# Altium schematic sheet EXP_OBC_COMM.SchDoc: EXP_OBC_COMM
size A3; Date: 13/11/2025; DrawnBy: Văn Quý Tuân; Revision: 1; SheetNumber: 9; SheetTotal: 10; Size: A3; Subsystem: HW-11/11/25
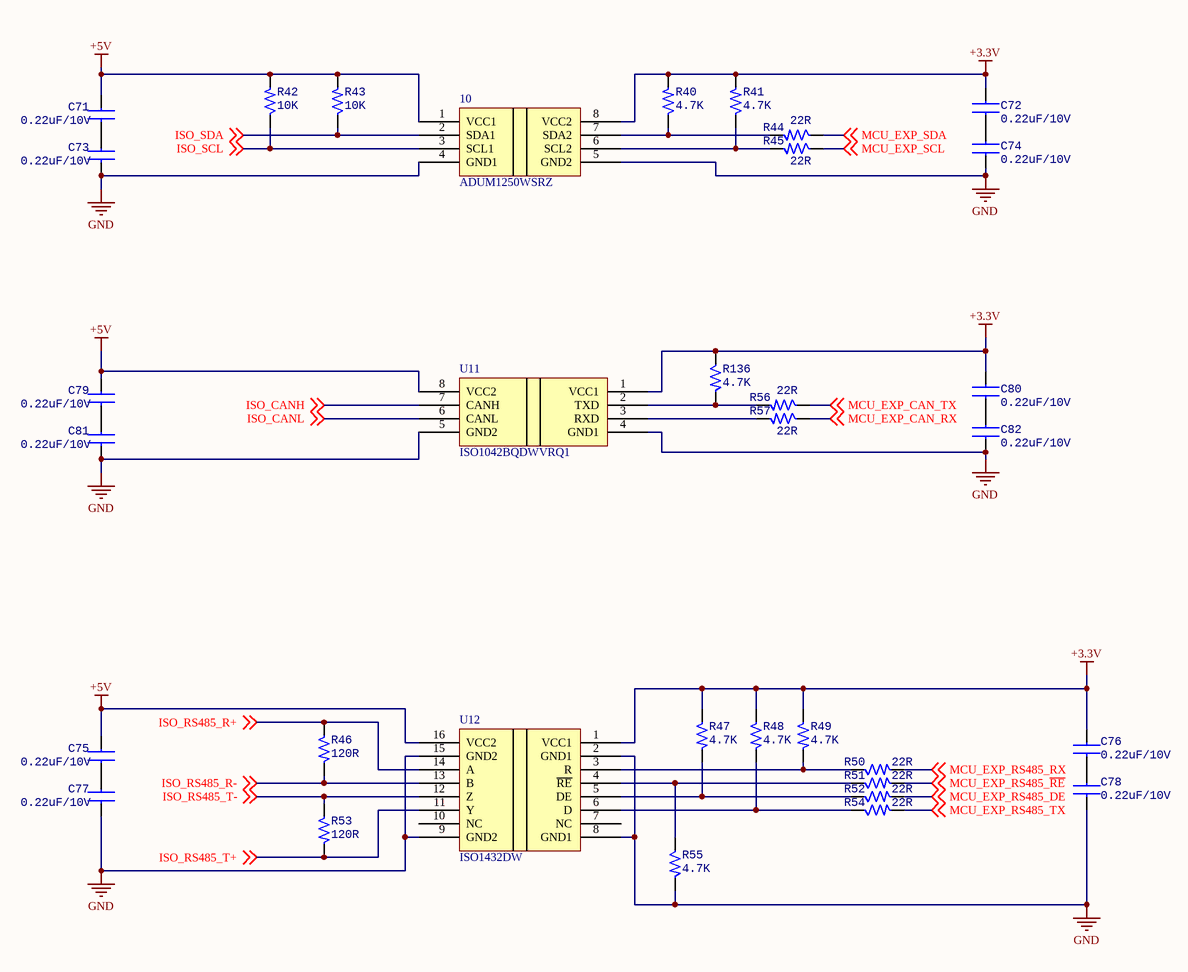
[diagram p0: EXP_OBC_COMM.SchDoc]

## Parts
10  ADUM1250WSRZ  [ADUM1250WSRZ]
C71  0.22uF/10V  [CAP-CER-0603]
C72  0.22uF/10V  [CAP-CER-0603]
C73  0.22uF/10V  [CAP-CER-0603]
C74  0.22uF/10V  [CAP-CER-0603]
C75  0.22uF/10V  [CAP-CER-0603]
C76  0.22uF/10V  [CAP-CER-0603]
C77  0.22uF/10V  [CAP-CER-0603]
C78  0.22uF/10V  [CAP-CER-0603]
C79  0.22uF/10V  [CAP-CER-0603]
C80  0.22uF/10V  [CAP-CER-0603]
C81  0.22uF/10V  [CAP-CER-0603]
C82  0.22uF/10V  [CAP-CER-0603]
R40  4.7K  [RES-SMD-0603]
R41  4.7K  [RES-SMD-0603]
R42  10K  [RES-SMD-0603]
R43  10K  [RES-SMD-0603]
R44  22R  [RES-SMD-0603]
R45  22R  [RES-SMD-0603]
R46  120R  [RES-SMD-0603]
R47  4.7K  [RES-SMD-0603]
R48  4.7K  [RES-SMD-0603]
R49  4.7K  [RES-SMD-0603]
R50  22R  [RES-SMD-0603]
R51  22R  [RES-SMD-0603]
R52  22R  [RES-SMD-0603]
R53  120R  [RES-SMD-0603]
R54  22R  [RES-SMD-0603]
R55  4.7K  [RES-SMD-0603]
R56  22R  [RES-SMD-0603]
R57  22R  [RES-SMD-0603]
R136  4.7K  [RES-SMD-0603]
U11  ISO1042BQDWVRQ1  [ISO1042BQDWVRQ1]
U12  ISO1432DW  [ISO1432DW]

## Nets
+3.3V: 10.8(VCC2) C72.2 C76.2 C80.2 R40.2 R41.2 R47.1 R48.1 R49.1 R136.1 U11.1(VCC1) U12.1(VCC1)
+5V: 10.1(VCC1) C71.2 C75.2 C79.2 R42.2 R43.2 U11.8(VCC2) U12.16(VCC2)
GND: 10.4(GND1) 10.5(GND2) C73.1 C74.1 C77.1 C78.1 C81.1 C82.1 R55.2 U11.4(GND1) U11.5(GND2) U12.2(GND1) U12.8(GND1) U12.9(GND2) U12.15(GND2)
ISO_CANH: U11.7(CANH) ; off-sheet ISO_CANH
ISO_CANL: U11.6(CANL) ; off-sheet ISO_CANL
ISO_RS485_R+: R46.1 U12.14(A) ; off-sheet ISO_RS485_R+
ISO_RS485_R-: R46.2 U12.13(B) ; off-sheet ISO_RS485_R-
ISO_RS485_T+: R53.2 U12.11(Y) ; off-sheet ISO_RS485_T+
ISO_RS485_T-: R53.1 U12.12(Z) ; off-sheet ISO_RS485_T-
ISO_SCL: 10.3(SCL1) R42.1 ; off-sheet ISO_SCL
ISO_SDA: 10.2(SDA1) R43.1 ; off-sheet ISO_SDA
MCU_EXP_CAN_RX: R57.1 ; off-sheet MCU_EXP_CAN_RX
MCU_EXP_CAN_TX: R56.1 ; off-sheet MCU_EXP_CAN_TX
MCU_EXP_RS485_DE: R52.2 ; off-sheet MCU_EXP_RS485_DE
MCU_EXP_RS485_~{RE}: R51.2 ; off-sheet MCU_EXP_RS485_~{RE}
MCU_EXP_RS485_RX: R50.2 ; off-sheet MCU_EXP_RS485_RX
MCU_EXP_RS485_TX: R54.2 ; off-sheet MCU_EXP_RS485_TX
MCU_EXP_SCL: R45.1 ; off-sheet MCU_EXP_SCL
MCU_EXP_SDA: R44.1 ; off-sheet MCU_EXP_SDA
Net10_6: 10.6(SCL2) R41.1 R45.2
Net10_7: 10.7(SDA2) R40.1 R44.2
NetC71_1: C71.1 C73.2
NetC72_1: C72.1 C74.2
NetC75_1: C75.1 C77.2
NetC76_1: C76.1 C78.2
NetC79_1: C79.1 C81.2
NetC80_1: C80.1 C82.2
NetR47_2: R47.2 R52.1 U12.5(DE)
NetR48_2: R48.2 R54.1 U12.6(D)
NetR49_2: R49.2 R50.1 U12.3(R)
NetR51_1: R51.1 R55.1 U12.4(~{RE})
NetR56_2: R56.2 R136.2 U11.2(TXD)
NetR57_2: R57.2 U11.3(RXD)

Not connected (* = marked no-connect by the designer): U12 7(NC) 10(NC)

## Notes on the sheet
- Project:
- Sub-system:
- Checked by:
- Design by:
- Sheet title:
- Doc no:
- Sheet
- Size
- Approved by:
- Revision:
- Date
- Text

## Library data of the parts
C71-C82 = CAP-CER
R40-R57 R136 = RES-SMD